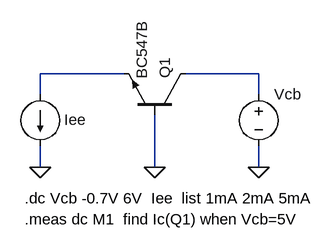
[diagram p0: schematic BT-CB-OUT.asc]
BT-CB-OUT.asc, the LTspice schematic file:
Version 4
SHEET 1 880 680
WIRE 160 112 32 112
WIRE 368 112 256 112
WIRE 32 144 32 112
WIRE 368 144 368 112
WIRE 32 256 32 224
WIRE 208 256 208 176
WIRE 368 256 368 224
FLAG 208 256 0
FLAG 32 256 0
FLAG 368 256 0
SYMBOL voltage 368 128 R0
WINDOW 3 24 32 Invisible 2
WINDOW 123 0 0 Left 2
WINDOW 39 0 0 Left 2
SYMATTR Value 0
SYMATTR InstName Vcb
SYMBOL current 32 144 R0
WINDOW 0 37 39 Left 2
WINDOW 3 24 0 Invisible 2
WINDOW 123 0 0 Left 2
WINDOW 39 0 0 Left 2
SYMATTR InstName Iee
SYMATTR Value 0
SYMBOL npn 256 176 M270
SYMATTR InstName Q1
SYMATTR Value BC547B
TEXT 8 304 Left 2 !.dc Vcb -0.7V 6V  Iee  list 1mA 2mA 5mA
TEXT 8 336 Left 2 !.meas dc M1  find Ic(Q1) when Vcb=5V

The netlist it stands for:
* BT-CB-OUT.asc
Vcb N002 0 0
Iee N001 0 0
Q1 N002 0 N001 0 BC547B
.model NPN NPN
.model PNP PNP
.lib standard.bjt
.dc Vcb -0.7V 6V  Iee  list 1mA 2mA 5mA
.meas dc M1  find Ic(Q1) when Vcb=5V
.backanno
.end